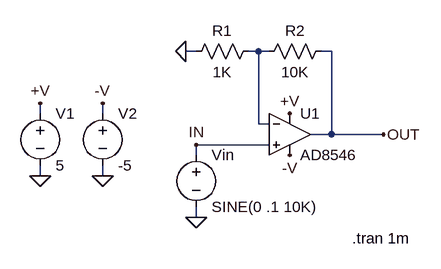
[diagram p0: schematic AD8546.asc]
AD8546.asc, the LTspice schematic file:
Version 4
SHEET 1 1336 700
WIRE 448 -1200 432 -1200
WIRE 544 -1200 528 -1200
WIRE 560 -1200 544 -1200
WIRE 656 -1200 640 -1200
WIRE 208 -1104 208 -1120
WIRE 304 -1104 304 -1120
WIRE 544 -1088 544 -1200
WIRE 560 -1088 544 -1088
WIRE 656 -1072 656 -1200
WIRE 656 -1072 624 -1072
WIRE 736 -1072 656 -1072
WIRE 560 -1056 448 -1056
WIRE 448 -1040 448 -1056
WIRE 208 -1008 208 -1024
WIRE 304 -1008 304 -1024
WIRE 448 -944 448 -960
FLAG 448 -944 0
FLAG 736 -1072 OUT
FLAG 448 -1056 IN
FLAG 592 -1104 +V
FLAG 592 -1040 -V
FLAG 432 -1200 0
FLAG 208 -1120 +V
FLAG 208 -1008 0
FLAG 304 -1120 -V
FLAG 304 -1008 0
SYMBOL voltage 448 -1056 R0
WINDOW 123 24 146 Left 2
WINDOW 39 24 125 Left 2
SYMATTR InstName Vin
SYMATTR Value SINE(0 .1 10K)
SYMBOL res 544 -1216 R90
WINDOW 0 0 56 VBottom 2
WINDOW 3 32 56 VTop 2
SYMATTR InstName R1
SYMATTR Value 1K
SYMBOL res 656 -1216 R90
WINDOW 0 0 56 VBottom 2
WINDOW 3 32 56 VTop 2
SYMATTR InstName R2
SYMATTR Value 10K
SYMBOL Opamps\\AD8546 592 -1136 R0
SYMATTR InstName U1
SYMBOL voltage 208 -1120 R0
WINDOW 123 0 0 Left 2
WINDOW 39 0 0 Left 2
SYMATTR InstName V1
SYMATTR Value 5
SYMBOL voltage 304 -1120 R0
WINDOW 123 24 146 Left 2
WINDOW 39 24 125 Left 2
SYMATTR InstName V2
SYMATTR Value -5
TEXT 688 -912 Left 2 !.tran 1m

The netlist it stands for:
* AD8546.asc
Vin IN 0 SINE(0 .1 10K)
R1 N001 0 1K
R2 OUT N001 10K
XU1 IN N001 +V -V OUT AD8546  ; pins In+ In- V+ V- OUT
V1 +V 0 5
V2 -V 0 -5
.tran 1m
.backanno
.end